# EAGLE design LCM v1.2 (EAGLE 5.06)
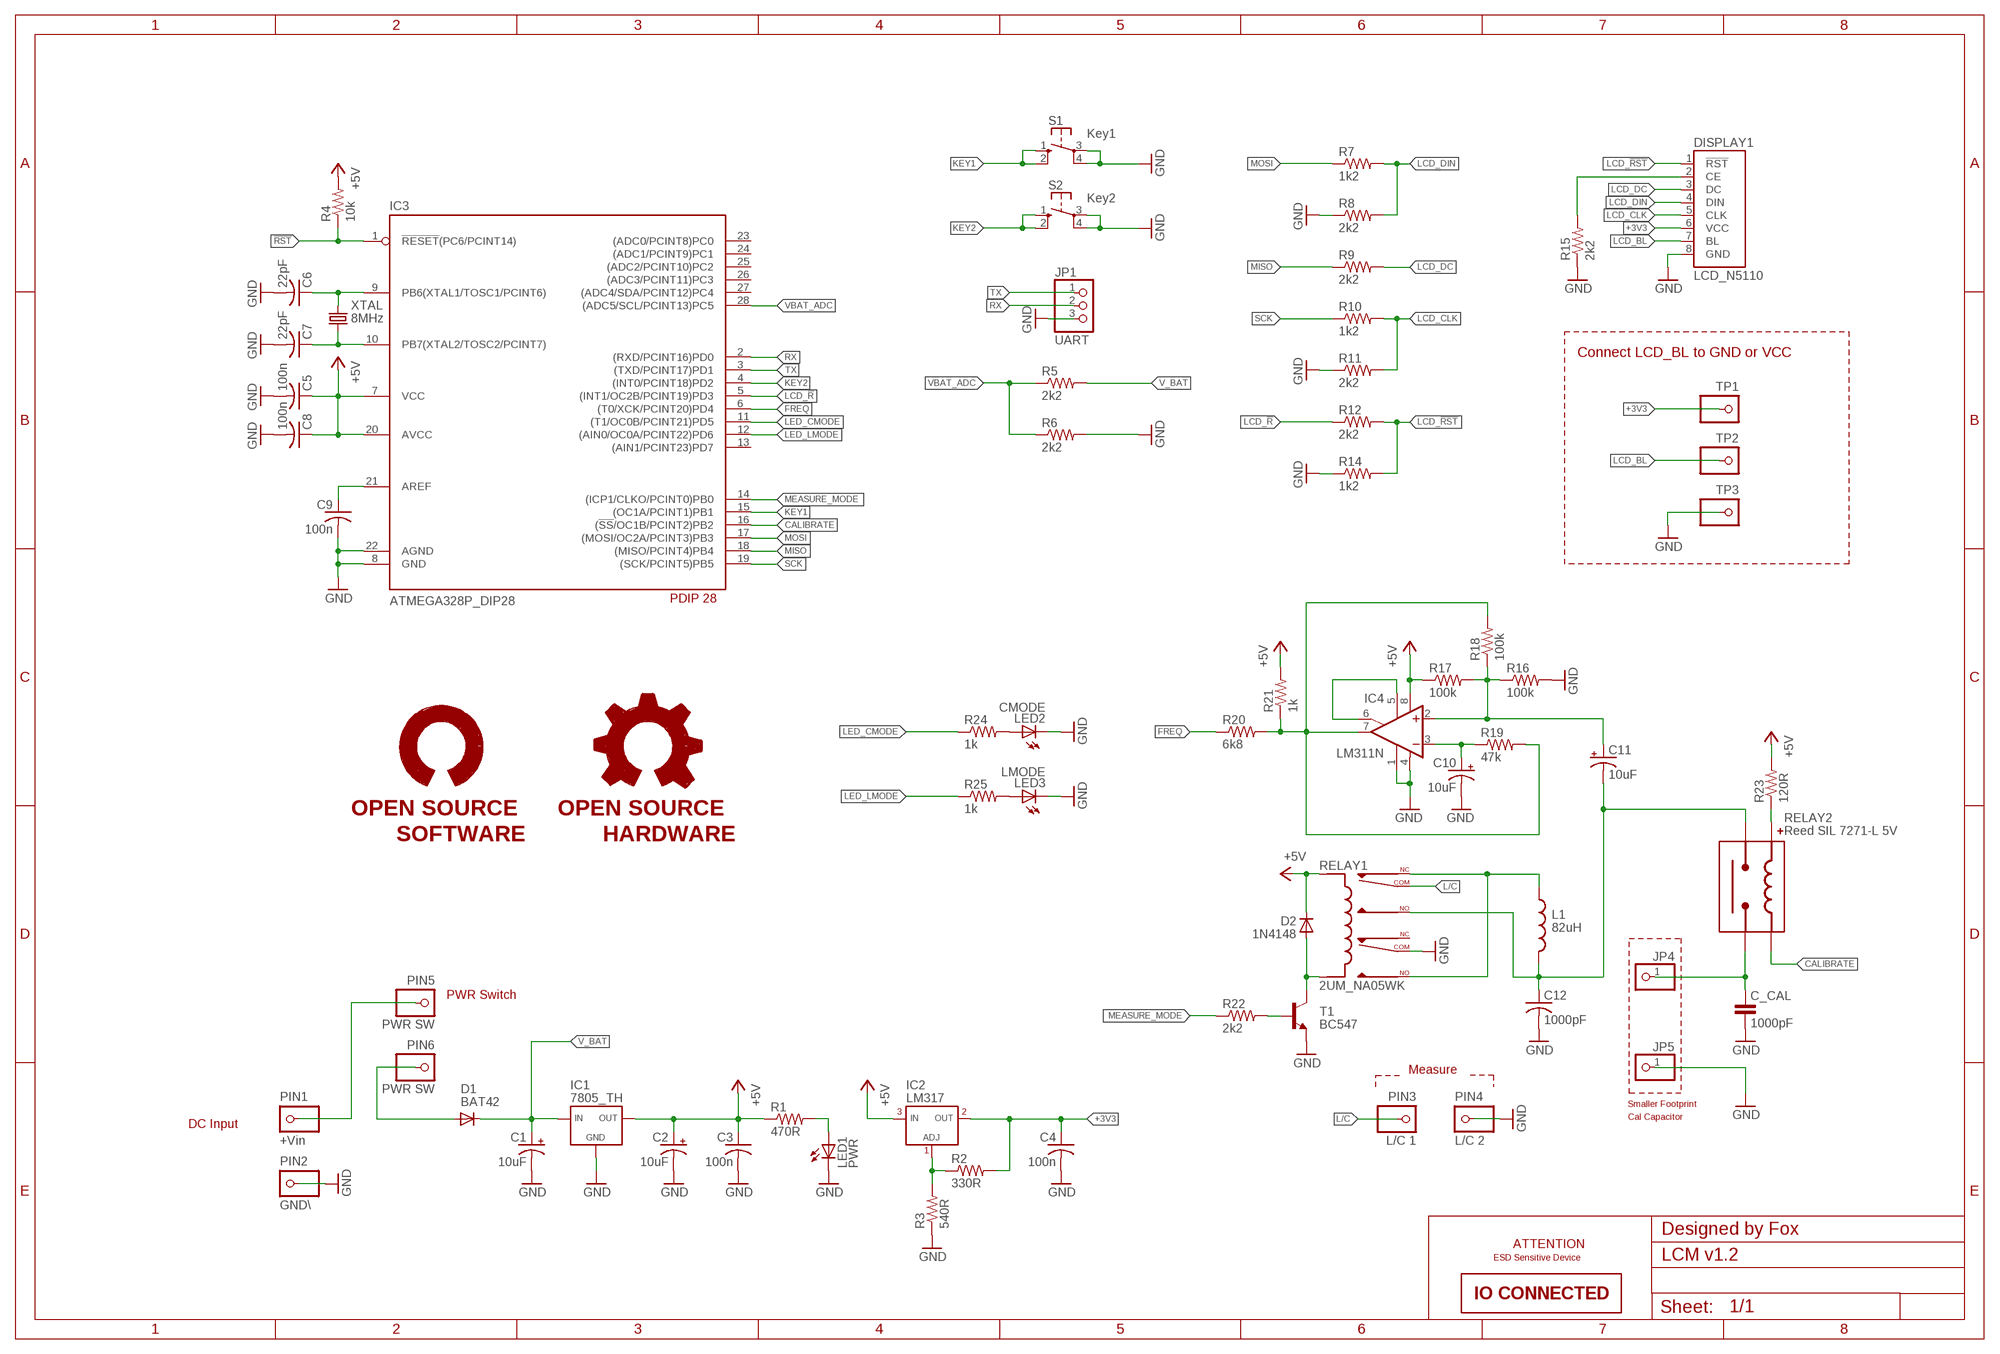
[diagram p0: schematic, sheet 1]

## Parts
C1  10uF  CPOL-USE2-4  [E2-4]
C2  10uF  CPOL-USE2-4  [E2-4]
C3  100n  C-US025-025X050  [C025-025X050]
C4  100n  C-US025-025X050  [C025-025X050]
C5  100n  C-US025-025X050  [C025-025X050]
C6  22pF  C-US025-025X050  [C025-025X050]
C7  22pF  C-US025-025X050  [C025-025X050]
C8  100n  C-US025-025X050  [C025-025X050]
C9  100n  C-US025-025X050  [C025-025X050]
C10  10uF  CPOL-USE2-4  [E2-4]
C11  10uF  CPOL-USE2-4  [E2-4]
C12  1000pF  C-US050-045X075  [C050-045X075]
C_CAL  1000pF  C  [C_11.5X4.5]
D1  BAT42  1N4148DO35-7  [DO35-7]
D2  1N4148  1N4148DO35-7  [DO35-7]
DISPLAY1  LCD_N5110  LCD_N5110_RED_DOUBLE_HEADER_T  [N5110LCD_TOPHEADER]
IC1  7805_TH  [TO220_NOHOLE]
IC2  LM317  [TO92]
IC3  ATMEGA328P_DIP28  [DIP28]
IC4  LM311N  [DIL08]
JP1  UART  PINHD-1X03_2.54-S  [1X03-S]
JP4  PINHD-1X1  [1X01]
JP5  PINHD-1X1  [1X01]
L1  82uH  L-US0204/7  [0204/7]
LED1  PWR  LED_3MM  [LED_3MM]
LED2  CMODE  LED_3MM  [LED_3MM]
LED3  LMODE  LED_3MM  [LED_3MM]
LOGO1  IO-CONNECTED_LOGOS  [IO_LOGO1]
PIN1  +Vin  PIN_2.54  [PIN_2.54]
PIN2  GND\  PIN_2.54  [PIN_2.54]
PIN3  L/C 1  PIN_2.54  [PIN_2.54]
PIN4  L/C 2  PIN_2.54  [PIN_2.54]
PIN5  PWR SW  PIN_2.54  [PIN_2.54]
PIN6  PWR SW  PIN_2.54  [PIN_2.54]
R1  470R  R-US_0204/7  [0204/7]
R2  330R  R-US_0204/7  [0204/7]
R3  540R  R-US_0204/7  [0204/7]
R4  10k  R-US_0204/7  [0204/7]
R5  2k2  R-US_0204/7  [0204/7]
R6  2k2  R-US_0204/7  [0204/7]
R7  1k2  R-US_0204/7  [0204/7]
R8  2k2  R-US_0204/7  [0204/7]
R9  2k2  R-US_0204/7  [0204/7]
R10  1k2  R-US_0204/7  [0204/7]
R11  2k2  R-US_0204/7  [0204/7]
R12  2k2  R-US_0204/7  [0204/7]
R14  1k2  R-US_0204/7  [0204/7]
R15  2k2  R-US_0204/7  [0204/7]
R16  100k  R-US_0204/7  [0204/7]
R17  100k  R-US_0204/7  [0204/7]
R18  100k  R-US_0204/7  [0204/7]
R19  47k  R-US_0204/7  [0204/7]
R20  6k8  R-US_0204/7  [0204/7]
R21  1k  R-US_0204/7  [0204/7]
R22  2k2  R-US_0204/7  [0204/7]
R23  120R  R-US_0204/7  [0204/7]
R24  1k  R-US_0204/7  [0204/7]
R25  1k  R-US_0204/7  [0204/7]
RELAY1  2UM_NA05WK  RELAY_2UMNA05WK  [NA05WK]
RELAY2  Reed SIL 7271-L 5V  REED_RELAY  [SIL71L]
S1  Key1  10-XX  [B3F-10XX]
S2  Key2  10-XX  [B3F-10XX]
T1  BC547  TRANSISTOR_NPN"  [TO92_CBE]
TP1  TESTPADTP3  [PAD3]
TP2  TESTPADTP3  [PAD3]
TP3  TESTPADTP3  [PAD3]
U$1  ESD_LOGO1.5  [ESD_SMALL]
XTAL  8MHz  CRYSTALHC49U-V  [HC49U-V]

## Nets
!RST: IC3.1(!RESET!(PC6/PCINT14)) R4.1
+3V3: C4.1 DISPLAY1.6(VCC) IC2.2(OUT) R2.2 TP1.P$1
+5V: C2.+ C3.1 C5.1 C8.1 D2.C IC1.3(OUT) IC2.1(IN) IC3.7(VCC) IC3.20(AVCC) IC4.8(V+) R1.1 R4.2 R17.1 R21.2 R23.2 RELAY1.12(C2)
CALIBRATE: IC3.16((!SS!/OC1B/PCINT2)PB2) RELAY2.5
FREQ: IC3.6((T0/XCK/PCINT20)PD4) R20.1
GND: C1.- C2.- C3.2 C4.2 C5.2 C6.2 C7.2 C8.2 C9.2 C10.- C12.2 C_CAL.2 DISPLAY1.8(GND) IC1.2(GND) IC3.8(GND) IC3.22(AGND) IC4.1(GND) IC4.4(V-) JP1.3 JP5.1 LED1.K(C) LED2.K(C) LED3.K(C) PIN2.1 PIN4.1 R3.1 R6.2 R8.1 R11.1 R14.1 R15.1 R16.2 RELAY1.9(COM2) S1.3(P) S1.4(P1) S2.3(P) S2.4(P1) T1.E TP3.P$1
KEY1: IC3.15((OC1A/PCINT1)PB1) S1.1(S) S1.2(S1)
KEY2: IC3.4((INT0/PCINT18)PD2) S2.1(S) S2.2(S1)
L/C: PIN3.1 RELAY1.4(COM1)
LCD_!R: IC3.5((INT1/OC2B/PCINT19)PD3) R12.1
LCD_!RST: DISPLAY1.1(!RST!) R12.2 R14.2
LCD_BL: DISPLAY1.7(BL) TP2.P$1
LCD_CLK: DISPLAY1.5(CLK) R10.2 R11.2
LCD_DC: DISPLAY1.3(DC) R9.2
LCD_DIN: DISPLAY1.4(DIN) R7.2 R8.2
LED_CMODE: IC3.11((T1/OC0B/PCINT21)PD5) R24.1
LED_LMODE: IC3.12((AIN0/OC0A/PCINT22)PD6) R25.1
MEASURE_MODE: IC3.14((ICP1/CLKO/PCINT0)PB0) R22.1
MISO: IC3.18((MISO/PCINT4)PB4) R9.1
MOSI: IC3.17((MOSI/OC2A/PCINT3)PB3) R7.1
N$1: DISPLAY1.2(CE) R15.2
N$2: C9.1 IC3.21(AREF)
N$3: LED1.A R1.2
N$4: IC2.3(ADJ) R2.1 R3.2
N$5: IC4.5(ON) IC4.6(ON/STR)
N$6: C11.+ IC4.2(+IN) R16.1 R17.2 R18.1
N$7: C10.+ IC4.3(-IN) R19.1
N$8: IC4.7(OUT) R18.2 R19.2 R20.2 R21.1
N$9: R23.1 RELAY2.3
N$10: LED3.A R25.2
N$12: C_CAL.1 JP4.1 RELAY2.7
N$14: R22.2 T1.B
N$16: LED2.A R24.2
N$17: D2.A RELAY1.1(C1) T1.C
N$18: C6.1 IC3.9(PB6(XTAL1/TOSC1/PCINT6)) XTAL.2
N$19: PIN1.1 PIN5.1
N$20: D1.A PIN6.1
N$24: C7.1 IC3.10(PB7(XTAL2/TOSC2/PCINT7)) XTAL.1
N$39: C11.- C12.1 L1.1 RELAY1.5(NO1) RELAY2.1
N$128: L1.2 RELAY1.3(NC1) RELAY1.8(NO2)
RX: IC3.2((RXD/PCINT16)PD0) JP1.2
SCK: IC3.19((SCK/PCINT5)PB5) R10.1
TX: IC3.3((TXD/PCINT17)PD1) JP1.1
V_BAT: C1.+ D1.C IC1.1(IN) R5.2
VBAT_ADC: IC3.28((ADC5/SCL/PCINT13)PC5) R5.1 R6.1
Unconnected: IC3.13((AIN1/PCINT23)PD7) IC3.23((ADC0/PCINT8)PC0) IC3.24((ADC1/PCINT9)PC1) IC3.25((ADC2/PCINT10)PC2) IC3.26((ADC3/PCINT11)PC3) IC3.27((ADC4/SDA/PCINT12)PC4) RELAY1.10(NC2)

## Notes on the sheet
- Connect LCD_BL to GND or VCC
- PWR Switch
- Measure
- Smaller Footprint
- Cal Capacitor
- DC Input

## Library data of the parts
C1 C2 C10 C11 = rcl:CPOL-US: POLARIZED CAPACITOR, American symbol
C3-C9 C12 = rcl:C-US: CAPACITOR, American symbol
C_CAL = _my-parts:C
D1 D2 = diode:1N4148: DIODE high speed (Philips)
DISPLAY1 = _my-parts:LCD_N5110
IC1 = _my-parts:7805
IC2 = _my-parts:LM317
IC3 = _my-parts:ATMEGA328P_DIP28
IC4 = linear:LM311: COMPARATOR
JP1 = pinhead-2:PINHD-1X03: PIN HEADER
JP4 JP5 = pinhead:PINHD-1X1: PIN HEADER
L1 = rcl:L-US: INDUCTOR, American symbol
LED1-LED3 = _my-parts:LED
LOGO1 = _my-parts:IO-CONNECTED_LOGO
PIN1-PIN6 = _my-parts:PIN
R1-R12 R14-R25 = rcl:R-US_: RESISTOR, American symbol
RELAY1 = _my-parts:RELAY_2UM
RELAY2 = _my-parts:REED_RELAY
S1 S2 = switch-omron:10-XX: OMRON SWITCH
T1 = _my-parts:TRANSISTOR_NPN
TP1-TP3 = _my-parts:TESTPAD
U$1 = _my-parts:ESD_LOGO
XTAL = crystal:CRYSTAL: CRYSTAL

## Board
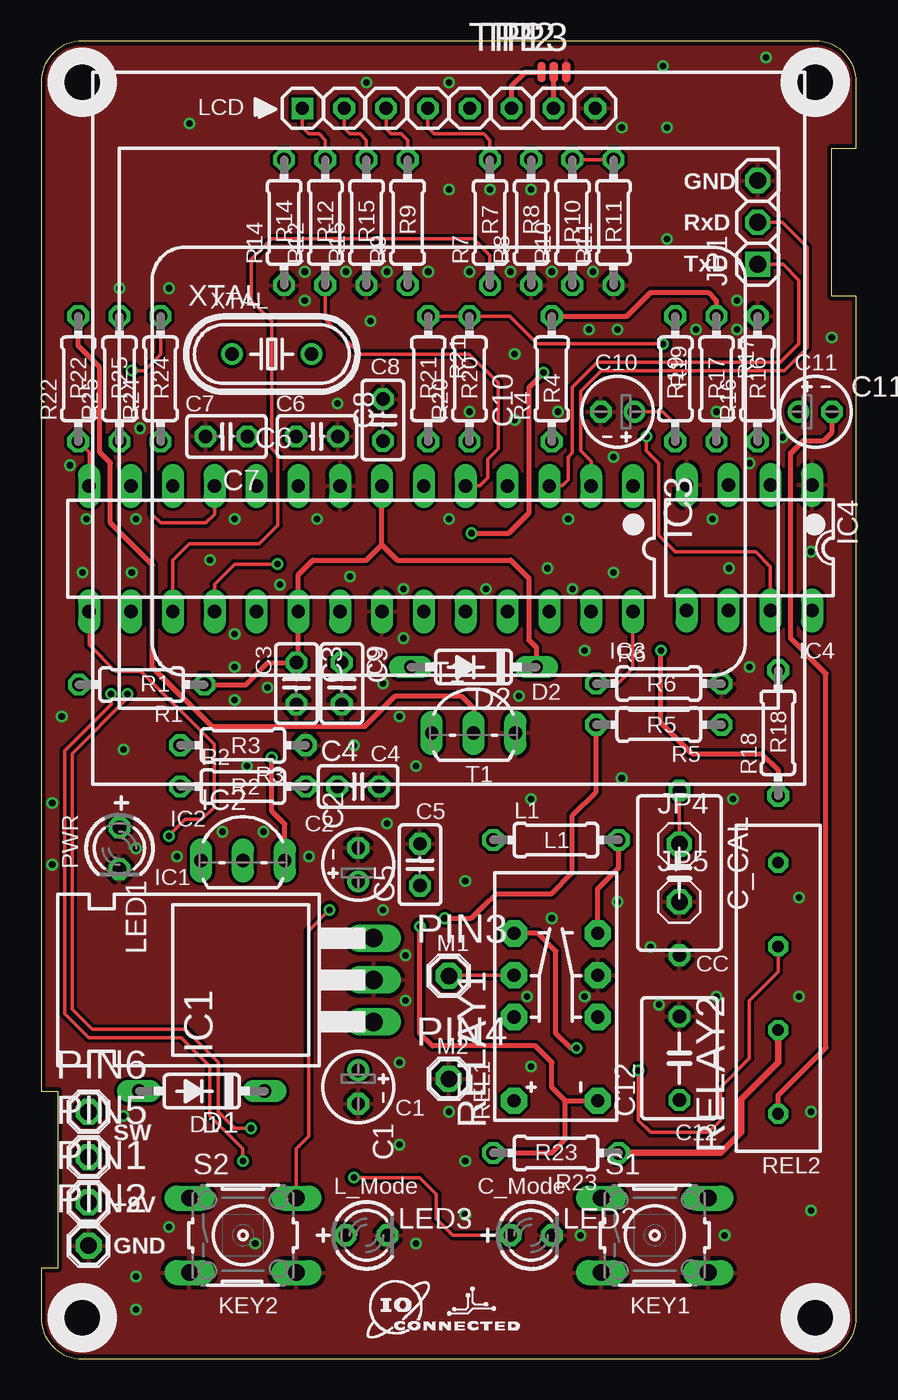
[diagram p1: board, top side]
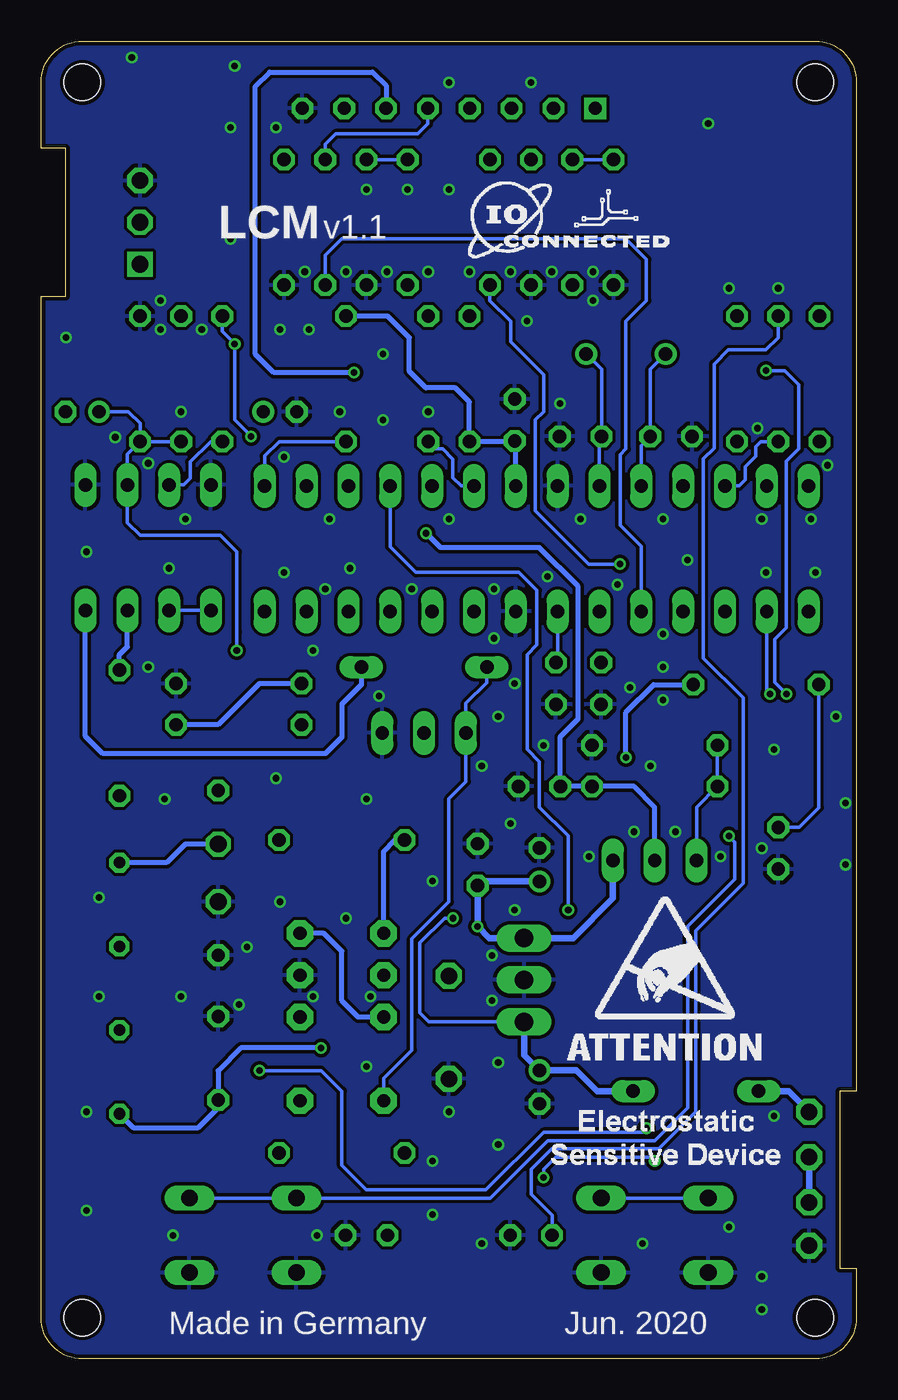
[diagram p2: board, bottom side, seen from below]

Size 49.5 x 80 mm. Coordinates in mm from the lower left corner, seen from the top.
Outline: 0,16.25 1,16.25 1,5.5 0,5.5 0,2.5 arc90 2.5,0 47,0 arc90 49.5,2.5 49.5,64.5 48,64.5 48,73.5 49.5,73.5 49.5,77.5 arc90 47,80 2.5,80 arc90 0,77.5 0,16.25
Copper layers (1*16): Top 0.035mm / dielectric 1.5mm / Bottom 0.035mm
Design rules "ITEADstudio_DRC *": minimum track width 6mil, minimum drill 12mil, track to track 6mil, track to pad 6mil, pad to pad 6mil, via to via 6mil, smd to smd 0mil, copper to edge 10mil, drill to drill 10mil, minimum pad ring 10mil, minimum via ring 6mil, stop-mask expansion 2mil, vias tented up to drill 100mil, thermal gap 10mil
Holes 2.2 mm at 2.5,2.5 47,2.5 47,77.5 2.5,77.5

### Footprints (pad centres in the part's own frame; a part is rotated, then mirrored left to right if it is on the bottom)
E2-4 = drill 0.813 pad 1.27 round: + -1.016,0 | drill 0.813 pad 1.27 octagon: - 1.016,0
C025-025X050 = drill 0.813 octagon: 1 -1.27,0; 2 1.27,0
C050-045X075 = drill 0.813 octagon: 1 -2.54,0; 2 2.54,0
C_11.5X4.5 = drill 0.813 octagon: 1 -5,0; 2 5,0
DO35-7 = drill 0.813 long: A 3.81,0; C -3.81,0
N5110LCD_TOPHEADER = drill 0.8 square: 1 -8.89,19.425 | drill 0.8 octagon: 2 -6.35,19.425; 3 -3.81,19.425; 4 -1.27,19.425; 5 1.27,19.425; 6 3.81,19.425; 7 6.35,19.425; 8 8.89,19.425
TO220_NOHOLE = drill 1.118 long: 1 -2.54,-11.43; 2 0,-11.43; 3 2.54,-11.43
TO92 = drill 0.813 long: 1 -2.54,0; 2 0,0; 3 2.54,0
DIP28 = drill 0.813 long: 1 -16.18,-4; 2 -13.64,-4; 3 -11.1,-4; 4 -8.56,-4; 5 -6.02,-4; 6 -3.48,-4; 7 -0.94,-4; 8 1.6,-4; 9 4.14,-4; 10 6.68,-4; 11 9.22,-4; 12 11.76,-4; 13 14.3,-4; 14 16.84,-4; 15 16.84,3.62; 16 14.3,3.62; 17 11.76,3.62; 18 9.22,3.62; 19 6.68,3.62; 20 4.14,3.62; 21 1.6,3.62; 22 -0.94,3.62; 23 -3.48,3.62; 24 -6.02,3.62; 25 -8.56,3.62; 26 -11.1,3.62; 27 -13.64,3.62; 28 -16.18,3.62
DIL08 = drill 0.813 long: 1 -3.81,-3.81; 2 -1.27,-3.81; 3 1.27,-3.81; 4 3.81,-3.81; 5 3.81,3.81; 6 1.27,3.81; 7 -1.27,3.81; 8 -3.81,3.81
1X03-S = drill 1.016 square: 1 -2.54,0 | drill 1.016 octagon: 2 0,0; 3 2.54,0
1X01 = drill 1.016 octagon: 1 0,0
0204/7 = drill 0.813 octagon: 1 -3.81,0; 2 3.81,0
LED_3MM = drill 0.813 octagon: A -1.27,0; K 1.27,0
PIN_2.54 = drill 1 pad 1.58 octagon: 1 0,0
NA05WK = drill 0.8 pad 1.6 octagon: 1 -6.33,2.54; 3 -1.25,2.54; 4 1.29,2.54; 5 3.83,2.54; 8 3.83,-2.54; 9 1.29,-2.54; 10 -1.25,-2.54; 12 -6.33,-2.54
SIL71L = drill 0.7 octagon: 1 -7.62,0; 3 -2.54,0; 5 2.54,0; 7 7.62,0
B3F-10XX = drill 1.016 long: 1 -3.251,2.261; 2 3.251,2.261; 3 -3.251,-2.261; 4 3.251,-2.261
TO92_CBE = drill 0.813 long: B 0,0; C -2.54,0; E 2.54,0
PAD3 = smd 0.5 x 1.2: P$1 0,0
HC49U-V = drill 0.813 round: 1 -2.413,0; 2 2.413,0

### Placement (x,y rotation side)
C1  19.25,16.5 270 top
C2  19.25,30 90 top
C3  15.5,41 270 top
C4  19.25,34.75 0 top
C5  23,30 90 top
C6  16.75,56 0 top
C7  11.25,56 180 top
C8  20.75,57 90 top
C9  18.25,41 270 top
C10  35,57.5 180 top
C11  47,57.5 0 top
C12  38.75,18.25 90 top
C_CAL  38.75,29.5 270 top
D1  9.75,16.25 180 top
D2  26.25,42 180 top
DISPLAY1  24.75,56.5 0 top
IC1  8.75,23 90 top
IC2  12.25,30.25 180 top
IC3  19.75,49 180 top
IC4  43,49.25 180 top
JP1  43.5,69 90 top
JP4  38.75,31.25 0 top
JP5  38.75,27.75 0 top
L1  31.25,31.5 0 top
LED1  4.75,31 270 top
LED2  29.75,7.5 0 top
LED3  19.75,7.5 0 top
LOGO1  24.25,66.5 0 bottom
PIN1  2.88,9.5 0 top
PIN2  2.88,6.88 0 top
PIN3  24.75,23.25 0 top
PIN4  24.75,17 0 top
PIN5  2.88,12.25 0 top
PIN6  2.88,15 0 top
R1  6.1,40.94 180 top
R2  12.25,34.75 0 top
R3  12.25,37.25 180 top
R4  31,59.5 90 top
R5  37.5,38.5 180 top
R6  37.5,41 0 top
R7  27.25,69 90 top
R8  29.75,69 90 top
R9  22.25,69 90 top
R10  32.25,69 90 top
R11  34.75,69 90 top
R12  17.25,69 90 top
R14  14.75,69 90 top
R15  19.75,69 90 top
R16  43.5,59.5 90 top
R17  41,59.5 270 top
R18  44.75,38 90 top
R19  38.5,59.5 90 top
R20  26,59.5 90 top
R21  23.5,59.5 270 top
R22  2.25,59.5 90 top
R23  31.25,12.5 180 top
R24  7.25,59.5 90 top
R25  4.75,59.5 90 top
RELAY1  31.25,22 90 top
RELAY2  44.75,22.5 90 top
S1  37.25,7.5 0 top
S2  12.25,7.5 0 top
T1  26.25,38 0 top
TP1  30.38,78.12 0 top
TP2  31.12,78.12 0 top
TP3  31.88,78.12 0 top
U$1  11.75,17.75 0 bottom
XTAL  14,61 0 top

### Tracks (layer width: path | path; a pad name or v marks a point on that pad's centre or on a via)
!RST
  Bottom 0.203: R4.1 35.06,55.69 35.93,54.82 IC3.1
+3V3  (via drill 0.4)
  Top 0.305: v26.12,50.12 28.38,50.12 29.62,51.38 29.62,59 v30.5,59.88 | TP1.P$1 29.38,78.12 28.56,77.31 DISPLAY1.6
  Bottom 0.305: IC2.2 12.25,33.5 13.5,34.75 R2.2 C4.1 17.98,37.77 16.9,38.85 16.9,46.9 19.25,49.25 25.25,49.25 v26.12,50.12 | v30.5,59.88 35.38,59.88 36.5,61 36.5,77.25 35.62,78.12 29.38,78.12 28.56,77.31 DISPLAY1.6
+5V  (via drill 0.4)
  Top 0.305: v23,26.25 23,19.75 23.75,19 30,19 31,18 31,16.5 31.83,15.67 | 31.83,15.67 RELAY1.12 | R1.1 12.44,40.94 13.77,42.27 C3.1 15.61,42.38 IC3.20 15.61,47.61 16.5,48.5 19.75,48.5 20.69,49.44 | 20.69,49.44 IC3.7 | 20.69,49.44 21.63,48.5 28.5,48.5 29.6,47.4 29.6,43.65 30.06,43.19 D2.C | v14,36.5 14,33.25 14.79,32.46 IC2.1 | R4.2 35.56,63.31 37,64.75 40.5,64.75 41,64.25 R17.1 | 31.83,15.67 31.83,13.33 31,12.5 R23.2
  Bottom 0.305: R4.2 28.46,63.31 27.15,62 27.15,59.95 26.15,58.95 24.35,58.95 23.5,58.1 R21.2 20.79,55.69 C8.1 20.69,55.67 IC3.7 | R1.1 12.31,40.94 14,39.25 v14,36.5 | IC4.8 46.81,37.81 45.75,36.75 32.25,36.75 31.25,37.75 31.25,39.75 30.06,40.94 D2.C
  Bottom 0.406: IC2.1 14.79,27.96 17.21,25.54 IC1.3 22.29,25.54 v23,26.25 C5.1 22.75,28.98 C2.+
CALIBRATE  (via drill 0.4)
  Top 0.203: v5.25,40.38 5.25,40.12 1.88,36.75 1.88,21.23 3.1,20 8.75,20 10.75,18 10.75,15 11.75,14 v12.75,14 | v36.25,17.5 36.25,14.5 37,13.75 40.5,13.75 41.25,14.5 41.25,16.5 43,18.25 43,21.75 44.75,23.5 RELAY2.5
  Bottom 0.203: IC3.16 5.45,40.58 v5.25,40.38 | v12.75,14 13,13.75 19,13.75 22.5,10.25 29.75,10.25 31.25,11.75 31.25,16.25 32.5,17.5 v36.25,17.5
FREQ
  Bottom 0.203: IC3.6 24,53 24.5,53.5 24.5,54.62 25.12,55.25 25.56,55.25 R20.1
GND  (via drill 0.4)
  other vias: 42.25,64.25 48,62 35,62.5 39.75,62.5 42.25,62.5 33.25,62.5 28.75,61 16,64.25 7.75,65 4.75,65 1.75,54.25 6,56.5 11.75,51 16.75,51 24.75,51 2.75,51 5.75,51 34.75,54.75 26,57.5 31.38,57.5 9,75 41.75,48 30.75,48 40.75,51 43,54.38 45,55.95 41,57.5 38,68 1.25,39 5,37 11.75,40 11.75,42 13.75,40.75 20.75,41 21.75,39 19,37.25 22.75,36 12.5,36 13.5,32 11,32 16.25,30.5 21,32.5 20.75,27.25 25.75,29 31,26.75 29.75,34 0.68,33.75 5.75,31 8.25,30.5 0.68,30 22.12,21.75 22.12,24.5 37.5,21.5 37,25 33,22 29.75,17.75 24.75,15 21.75,18 25.75,12 5.75,5 7.75,8 13,7 22.75,7 25.75,8.75 32.75,7.5 41.5,7.5 21.75,13 5,14.75 5.75,3 46.75,9 29,40.25 22,43.75 22,46.75 18.75,47.5 11.75,44 14.5,47 10.25,48.5 5.5,47.75 2.5,47.75 27,46.75 32.25,46.75 34.75,47.75 46.75,49 44,79 29.5,22 31,66 33.5,66 28.5,66 26,66 23.5,66 21,66 18.5,66 16,66 20,63 28.75,57 32,51 19.75,77.5 24.75,77.5 37.75,78.5 24.75,71 27.25,71 29.75,71 35.25,74.75 38,74.75 18,58 43,42 35.25,35.25 42,34 46,28 41,22 35,27.75 46.75,15 46,22 33,43
  pour Top (isolate 0.203): 0,5.5 1,5.5 1,16.38 0,16.38 0,77.5 arc-90 2.5,80 47,80 arc-90 49.5,77.5 49.5,73.5 48,73.5 48,64.5 49.5,64.5 49.5,2.5 arc-90 47,0 2.5,0 arc-90 0,2.5
  pour Bottom (isolate 0.203): 0,5.5 1,5.5 1,16.38 0,16.38 0,77.5 arc-90 2.5,80 47,80 arc-90 49.5,77.5 49.5,73.5 48,73.5 48,64.5 49.5,64.5 49.5,2.5 arc-90 47,0 2.5,0 arc-90 0,2.5
KEY1  (via drill 0.4)
  Top 0.203: IC3.15 2.91,43.34 4.5,41.75 6.05,41.75 10.5,37.3 10.5,33.5 9.75,32.75 8.75,32.75 v7.75,31.75
  Bottom 0.203: S1.2 S1.1 22.24,9.76 18.75,13.25 12.25,13.25 10.25,15.25 10.25,26.25 7.38,29.12 7.38,31.38 v7.75,31.75
KEY2  (via drill 0.4)
  Top 0.203: S2.2 15.5,12.75 16.25,13.5 16.25,26 v17.5,27.25
  Bottom 0.203: IC3.4 28.31,49.31 26.75,47.75 20.5,47.75 19.4,46.65 19.4,43.35 20,42.75 20,37 19.25,36.25 19.25,33.5 17.5,31.75 v17.5,27.25 | S2.1 S2.2
L/C
  Top 0.203: RELAY1.4 24.79,23.29 PIN3.1
LCD_!R
  Top 0.203: IC3.5 26.62,53 27.12,53.5 27.12,54.62 27.75,55.25 27.75,59.25 26,61 19.38,61 17.25,63.12 R12.1
LCD_!RST
  Top 0.203: DISPLAY1.1 15.86,74.77 16.25,74.38 16.88,74.38 17.25,74 R12.2
  Bottom 0.203: R14.2 R12.2
LCD_BL
  Top 0.305: DISPLAY1.7 31.12,75.95 TP2.P$1
LCD_CLK
  Top 0.203: R10.2 R11.2
  Bottom 0.203: DISPLAY1.5 26.02,74.98 26.62,74.38 31.62,74.38 32.25,73.75 R10.2
LCD_DC
  Top 0.203: DISPLAY1.3 20.94,74.69 21.25,74.38 21.88,74.38 22.25,74 R9.2
LCD_DIN
  Top 0.203: DISPLAY1.4 23.48,74.77 23.88,74.38 26.88,74.38 27.25,74 R7.2
  Bottom 0.203: R7.2 R8.2
LED_CMODE
  Top 0.203: IC3.11 10.53,51.28 10,50.75 7.25,50.75 6.75,51.25 6.75,55.19 R24.1
LED_LMODE
  Bottom 0.203: IC3.12 7.12,53 6.75,53.38 6.75,54.17 6.12,54.8 6.12,55.38 5.81,55.69 R25.1
MEASURE_MODE
  Top 0.203: IC3.14 2.91,55.03 R22.1
MISO  (via drill 0.4)
  Top 0.203: IC3.18 10.53,47.03 11.75,48.25 v14.35,48.25
  Bottom 0.203: v14.35,48.25 16.25,48.25 19.5,51.5 19.5,57 19,57.5 19,59.75 21,61.75 21,63 22.25,64.25 R9.1
MOSI
  Top 0.203: IC3.17 7.99,48.49 9,49.5 13.25,49.5 14.38,50.62 14.38,54.88 14,55.25 14,63 12.75,64.25 12.75,66.75 14,68 26.25,68 27.25,67 R7.1
N$1
  Top 0.203: DISPLAY1.2 18.4,74.72 18.75,74.38 19.38,74.38 19.75,74 R15.2
N$2
  Bottom 0.203: IC3.21 18.15,42.37 C9.1
N$3
  Bottom 0.203: R1.2 2.29,33.46 3.48,32.27 LED1.A
N$4
  Bottom 0.203: R3.2 R2.1 9.71,33.48 IC2.3
N$5
  Bottom 0.203: IC4.5 IC4.6
N$6  (via drill 0.4)
  Top 0.305: v37.62,43 37.62,38.62 39.5,36.75 43.75,36.75 44.75,35.75 R18.1
  Bottom 0.203: R16.1 R17.2 | R16.1 44.27,54.92 IC4.2 44.27,50.77 43.5,50 38.62,50 37.62,49 37.62,44.12 v37.62,43 | R16.1 43.5,56.8 44.2,57.5 C11.+
N$7
  Top 0.203: C10.+ 37.75,57.5 38.5,56.75 R19.1
  Bottom 0.203: IC4.3 40.84,53.06 40.45,53.45 40.45,54.45 39.21,55.69 R19.1
N$8  (via drill 0.4)
  Top 0.203: IC4.7 44.27,48.1 43.38,49 38.5,49 37.5,50 37.5,54.38 36.75,55.12 v36.75,56 | R21.1 R20.2 28.44,63.31 30.12,61.62 v37.75,61.62
  Bottom 0.203: R19.2 38.5,62.38 v37.75,61.62 37.75,57 v36.75,56
  Bottom 0.305: IC4.7 44.27,43.23 44.75,42.75 R18.2
N$9
  Top 0.406: RELAY2.3 44.75,18 42.5,15.75 42.5,13.75 41.25,12.5 R23.1
N$10
  Bottom 0.203: R25.2 4.75,62 5.5,61.25 7.8,61.25 8.65,60.4 8.65,55.3 9.3,54.65 9.3,42.55 6.88,40.12 6.88,28.88 9.75,26 9.75,15 12,12.75 18.5,12.75 19.75,11.5 19.75,10 18.48,8.73 LED3.A
N$12
  Top 0.203: JP4.1 C_CAL.1
  Bottom 0.305: JP4.1 40.75,31.25 41.88,30.12 RELAY2.7
N$14
  Top 0.305: T1.B 26.25,39.5 25.5,40.25 21.5,40.25 19.65,38.4 10.35,38.4 6.75,42 6.75,48.2 4.2,50.75 4.2,54.4 3.55,55.05 3.55,60.2 2.25,61.5 R22.2
N$16  (via drill 0.4)
  Top 0.203: v5.5,60 6.25,60 7.25,61 R24.2 | v19,11 23,11 24,10 24,8.5 25,7.5 LED2.A | v4.25,40.38 4.25,39.75 1.43,36.92 1.43,20.95 2.88,19.5 8.5,19.5 10.25,17.75 10.25,14.75 12.25,12.75 v12.25,12
  Bottom 0.203: v19,11 19,11.5 18.25,12.25 12.5,12.25 v12.25,12 | v4.25,40.38 4.95,41.08 4.95,43.67 4.25,44.38 4.25,54.5 3.5,55.25 3.5,59.15 4.35,60 v5.5,60
N$17
  Bottom 0.203: D2.A 22.44,41.06 23.71,39.79 T1.C 23.71,35.04 24.75,34 24.75,27.75 27,25.5 27,18.75 28.71,17.04 RELAY1.1
N$18
  Bottom 0.203: IC3.9 15.61,55.87 C6.1 15.48,60.07 XTAL.2
N$19
  Bottom 0.406: PIN1.1 PIN5.1
N$20
  Bottom 0.406: D1.A 4.12,16.25 PIN6.1
N$24
  Bottom 0.203: IC3.10 13.07,55.45 C7.1 12.52,60.07 XTAL.1
N$39  (via drill 0.4)
  Top 0.305: v32.5,18.88 32.12,18.88 31.25,19.75 31.25,24.75 30.17,25.83 RELAY1.5 | RELAY2.1 44.75,16 47.65,18.9 47.65,41.6 45.5,43.75 45.5,54.98 46.27,55.75 47.5,55.75 48.02,56.27 C11.-
  Bottom 0.305: RELAY1.5 28.71,30.79 28,31.5 L1.1 | v32.5,18.88 37.38,18.88 38.75,17.5 C12.1 38.75,15.25 40,14 43.87,14 RELAY2.1
N$128
  Top 0.305: RELAY1.8 33.79,28.54 35.06,29.81 L1.2
  Bottom 0.305: RELAY1.3 30.25,20.75 31.25,21.75 31.25,24.75 32.33,25.83 RELAY1.8
RX
  Top 0.203: IC3.2 33.39,54.48 32.75,55.12 32.75,58.75 34,60 45.12,60 46.5,61.38 46.5,67.5 45,69 JP1.2
SCK
  Bottom 0.203: IC3.19 13.07,49.32 14.35,50.6 14.35,54.9 14,55.25 14,63 12.75,64.25 12.75,66.75 14,68 31.25,68 32.25,67 R10.1
TX
  Top 0.203: IC3.3 31.62,53 32,53.38 32,54.75 32.25,55 32.25,59 33.75,60.5 44.88,60.5 46,61.62 46,65.5 45.04,66.46 JP1.1
V_BAT  (via drill 0.4)
  Top 0.305: v24.5,26.75 26.12,26.75 26.88,27.5 27.62,28.25 31,28.25 32.25,29.5 32.25,33 33.69,34.44 R5.2
  Bottom 0.203: IC1.1 25.96,20.46 26.5,21 26.5,25.25 25,26.75 v24.5,26.75
  Bottom 0.406: IC1.1 20.18,18.45 C1.+ 17.02,17.52 15.75,16.25 D1.C
VBAT_ADC
  Top 0.203: R6.1 35,41 35.93,41.93 IC3.28
  Bottom 0.305: R5.1 38.75,38.5 36.25,41 R6.1

### Text on the board
_tsilk: LCD | GND | R14 | R12 | R15 | R9 | R7 | R8 | R10 | R11 | RxD | TxD | XTAL | C8 | C10 | C11 | R22 | R25 | R24 | C7 | C6 | R21 | R20 | R4 | R19 | R17 | R16 | C3 | C9 | IC3 | IC4 | R1 | D2 | R6 | R5 | R3 | R18 | C4 | T1 | R2 | C5 | IC2 | C2 | L1 | PWR | IC1 | M1 | CC | M2 | C1 | D1 | REL1 | SW | C12 | R23 | REL2 | L_Mode | C_Mode | +9V | GND | KEY2 | KEY1
_bsilk: v1.1 | LCM | Jun. 2020 | Made in Germany